# Altium schematic sheet MC33035_cct.SchDoc
size A4
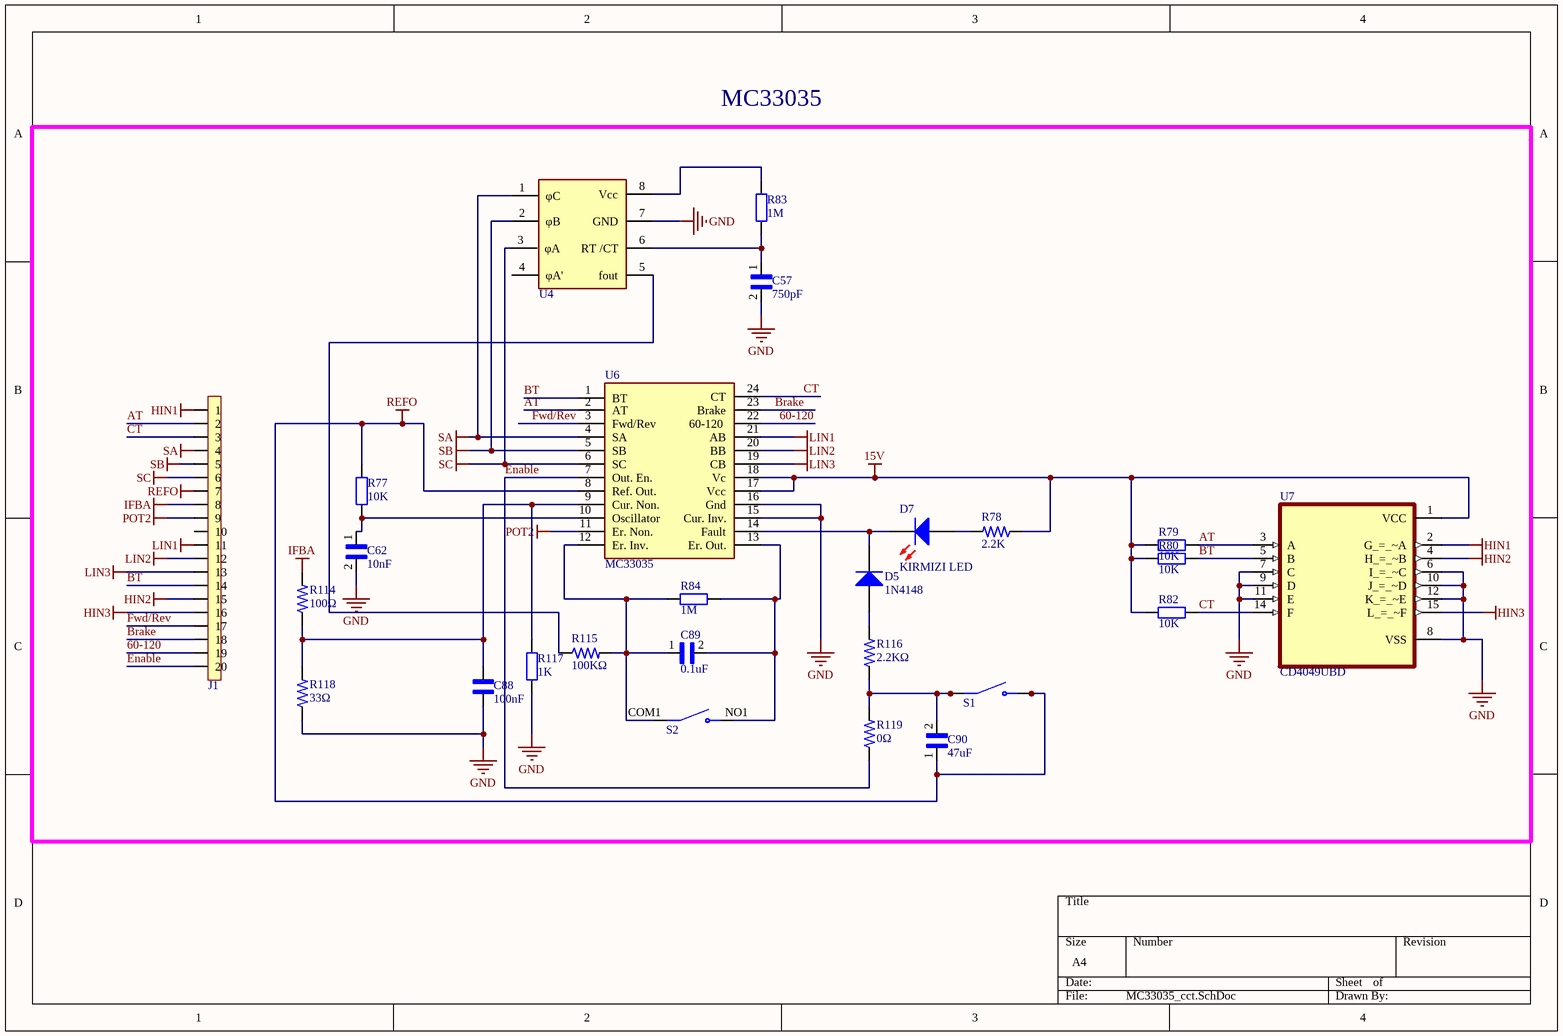
[diagram p0: MC33035_cct.SchDoc]

## Parts
C57  750pF  [CAPC1608X87N]
C62  10nF  [C-0805W]
C88  100nF  [C-0805W]
C89  0.1uF  [C-0805W]
C90  47uF  [CAPC3225X270N]
D5  1N4148 Diyot  [SOD-123]  (value not drawn)
D7  Deger: KIRMIZI LED  [SMD: LED 0805/2012 RED]  (hidden comment: Red 645nm LED Indication - Discrete 1.8V 0805)
J1  NHD-0208BZ-FL-YBW  [idc20]  (value not drawn)
R77  Deger: 10K  [R-0805W]  (hidden comment: RES SMD 10K OHM 1% 1/8W 0805)
R78  2.2K  [RESC3115X65N-2.2K-1206]
R79  Deger: 10K  [R-0805W]  (hidden comment: RES SMD 10K OHM 1% 1/8W 0805)
R80  Deger: 10K  [R-0805W]  (hidden comment: RES SMD 10K OHM 1% 1/8W 0805)
R82  Deger: 10K  [R-0805W]  (hidden comment: RES SMD 10K OHM 1% 1/8W 0805)
R83  Deger: 1M  [R-0805W]  (hidden comment: RES SMD 1M OHM 1% 1/8W 0805)
R84  Deger: 1M  [R-0805W]  (hidden comment: RES SMD 1M OHM 1% 1/8W 0805)
R114  100Ω  [R-0805W]
R115  100KΩ  [R-0805R]
R116  2.2KΩ  [R-0805W]
R117  Deger: 1K  [R-0805W]  (hidden comment: RES SMD 1K OHM 1% 1/8W 0805)
R118  33Ω  [R-0805W]
R119  0Ω  [RES 0.0 OHM 1206]
S1  Switch Tactile OFF (ON) SMD-6  [SW_1571563-7]  (value not drawn)
S2  SDA01H1SBD  [SW_SDA01H1SBD]  (value not drawn)
U4  MC33039  [SOIC127P600X175-8N]  (value not drawn)
U6  MC33035  [SOIC24(MC33035)]
U7  CD4049UBD  [SOIC127P600X175-16N]

## Blocks framed on the sheet
MC33035: C57 C62 C88-C90 D5 D7 J1 R77-R80 R82-R84 R114-R119 S1 S2 U4 U6 U7

## Nets
15V: R78.1 R79.2 R80.2 R82.2 U6.17(Vcc) U6.18(Vc) U7.1(VCC)
GND: C57.2 C62.2 C88.2 R117.1 R118.1 U4.7(GND) U6.15(Cur._Inv.) U6.16(Gnd) U7.6(I_=_~C) U7.7(C) U7.8(VSS) U7.9(D) U7.10(J_=_~D) U7.11(E) U7.12(K_=_~E)
HIN1: J1.1 U7.2(G_=_~A)
HIN2: J1.15 U7.4(H_=_~B)
HIN3: J1.16 U7.15(L_=_~F)
IFBA: J1.8 R114.2
LIN1: J1.11 U6.21(AB)
LIN2: J1.12 U6.20(BB)
LIN3: J1.13 U6.19(CB)
POT2: J1.9 U6.11(Er._Non.)
REFO: C90.1 J1.7 R77.2 S1.3(NO) S1.4(NO) U6.8(Ref._Out.)
SA: J1.4 U4.1(φC) U6.4(SA)
SB: J1.5 U4.2(φB) U6.5(SB)
SC: J1.6 U4.3(φA) U6.6(SC)
60-120: J1.19 U6.22(60-120)
AT: J1.2 R79.1 U6.2(AT) U7.3(A)
Brake: J1.18 U6.23(Brake)
BT: J1.14 R80.1 U6.1(BT) U7.5(B)
CT: J1.3 R82.1 U6.24(CT) U7.14(F)
Enable: J1.20 R119.1 U6.7(Out._En.)
Fwd/Rev: J1.17 U6.3(Fwd/Rev)
NetC57_1: C57.1 R83.1 U4.6(RT_/CT)
NetC62_1: C62.1 R77.1 U6.10(Oscillator)
NetC88_1: C88.1 R114.1 R117.2 R118.2 U6.9(Cur._Non.)
NetC89_1: C89.1 R84.1 R115.2 S2.COM1(COM) U6.12(Er._Inv.)
NetC89_2: C89.2 R84.2 S2.NO1(NO) U6.13(Er._Out.)
NetC90_2: C90.2 R116.1 R119.2 S1.1(COM) S1.2(COM)
NetD5_1: D5.1(A) R116.2
NetD5_2: D5.2(K) D7.2(K) U6.14(Fault)
NetD7_1: D7.1(A) R78.2
NetR83_2: R83.2 U4.8(Vcc)
NetR115_1: R115.1 U4.5(fout)

Not connected (* = marked no-connect by the designer): J1 10; U4 4(φA')

## Library data of the parts
C57 = CAP 750pF 0603 SMD: MP: C0603C751J3GAC7867; Package: None; Price: None; Value: *; Availability: Unavailable
C62 = CAP 10nF 0805: .01UF 25V 10% 0806; MP: C0805C103K3RACTU; Package: None; Price: None; Value: *; Availability: Unavailable
C88 = CAP 100nF 50V SMT 0805: WCAP-CSGP General Purpose MLCC; SMT 0805; X7R; 100nF 10%; 50V; -55C to +125C; Tech. PN X7R0805104K050DFCT10000; MF: Wurth Electronics Inc; MP: 885012207098; Availability: Warning; Mouser-Purchase-URL: https://snapeda.com/shop?store=Mouser&id=4217223; Price: None; DigiKey-Purchase-URL: https://snapeda.com/shop?store=DigiKey&id=4217223; Package: 0805 Wurth Electronics; Value: *; SnapEDA_Link: https://www.snapeda.com/parts/885012207098/Wurth%20Electronics%20Inc/view-part/4217223/?ref=snap; BuyPart: https://www.snapeda.com/parts/885012207098/Wurth%20Electronics%20Inc/view-part/4217223/?ref=eda
C89 = CAP 0.1uF SMD 0805: Cap Ceramic 0.1uF 35V X7R 10% SMD 0805 125Â°C Paper T/R; MP: C0805C104K6RACTU; MF: KEMET; SnapEDA_Link: https://www.snapeda.com/parts/C0805C104K6RACTU/KEMET/view-part/2037626/?ref=snap; Value: *; Availability: Unavailable; Package: 0805 KEMET; Price: None
C90 = CAP 47uF 3225 SMD: CAP, MLCC, AUTO, X7R, 47UF/6.3V, 1210; MP: GRT32ER70J476KE13L; Package: None; Price: None; Value: *; Availability: Unavailable
D5 = 1N4148: DIODE GEN PURP 100V 150MA SOD123; Uretici Kodu: 1N4148W-TP; -Sicaklik: -65; +Sicaklik: +150; Lehim Yöntemi: SMD; Cins: Diyot; Kılıf: SOD123; MSL: 1 (Unlimited); Deger: 1N4148
D7 = LED_Kırmızı: LED RED DIFFUSED 0805 SMD; Uretici Kodu: LH R974-LP-1; Kılıf: 0805; -Sicaklik: -40; +Sicaklik: +125; Cins: LED; Lehim Yöntemi: SMD; MSL: 1 (Unlimited)
J1 = IDC-20
R77 R79 R80 R82 = 10K 0805: 10 kOhms ±1% 0.125W, 1/8W Chip Resistor 0805 (2012 Metric) Moisture Resistant Thick Film; Cins: Direnc; Kılıf: 0805; Uretici Kodu: RC0805FR-0710KL; -Sicaklik: -55; +Sicaklik: +155; Lehim Yöntemi: SMD; MSL: 1 (Unlimited)
R78 = RES 2.2K 1206: RES SMD 2.2K OHM 1% 1/4W 1206; MP: CRG1206F2K2/10; Package: None; Price: None; Value: *; Availability: Unavailable
R83 R84 = 1M 0805: 1 MOhms ±1% 0.125W, 1/8W Chip Resistor 0805 (2012 Metric) Moisture Resistant Thick Film; Cins: Direnc; Uretici Kodu: RC0805FR-071ML; Kılıf: 0805; -Sicaklik: -55; +Sicaklik: +155; Lehim Yöntemi: SMD; MSL: 1 (Unlimited)
R114 = RES 100Ω 0805
R115 = RES 100KΩ 0805
R116 = RES 2.2KΩ 0805
R117 = 1K 0805: 1 kOhms ±1% 0.125W, 1/8W Chip Resistor 0805 (2012 Metric) Moisture Resistant Thick Film; Cins: Direnc; Uretici Kodu: RC0805FR-071KL; Kılıf: 0805; -Sicaklik: -55; +Sicaklik: +155; Lehim Yöntemi: SMD; MSL: 1 (Unlimited)
R118 = RES 33Ω 0805
R119 = RES 0.0 Ω 1206
S1 = Switch Tactile OFF (ON) SMD-6: Switch Tactile OFF (ON) SPST Round Button Gull Wing 0.05A 24VDC 1VA 0.98N SMD Loose; MF: TE Connectivity; MP: 1571563-7; Value: *; Availability: Unavailable; Price: None; SnapEDA_Link: https://www.snapeda.com/parts/1571563-7/TE%20Connectivity/view-part/2365663/?ref=snap; EU_RoHS_Compliance: Compliant; Package: SMD-6 Omron Electronics
S2 = SDA01H1SBD: Dip Switch SPST 1 Position Surface Mount Slide (Standard) Actuator 25mA 24VDC; MF: C&K; MP: SDA01H1SBD; Purchase-URL: https://pricing.snapeda.com/search/part/SDA01H1SBD/?ref=eda; SnapEDA_Link: https://www.snapeda.com/parts/SDA01H1SBD/C&K/view-part/2598524/?ref=snap; Price: None; Package: None; Value: *; Availability: Good; Check_prices: https://www.snapeda.com/parts/SDA01H1SBD/C&K/view-part/2598524/?ref=eda
U7 = CD4049UBD: CMOS Hex Inverting Buffer/Converter 16-SOIC -55 to 125; MF: Texas Instruments; Value: *; Price: None; Package: SOIC-16 Texas Instruments; SnapEDA_Link: https://www.snapeda.com/parts/CD4049UBD/Texas%20Instruments/view-part/291752/?ref=snap; Availability: Good; Purchase-URL: https://pricing.snapeda.com/search/part/CD4049UBD/?ref=eda; MP: CD4049UBD; Check_prices: https://www.snapeda.com/parts/CD4049UBD/Texas%20Instruments/view-part/291752/?ref=eda